# Altium schematic sheet Sheet0_Fontes_Chaveadas.SchDoc: Conversor Buck 24 V 100 W
size A4; Date: 15/11/2022; ApprovedBy: Prof. Me. Halisson Alves de Oliveira; CheckedBy: Manuel Batista Neto; Author: Artur Alves Torres de Araujo; DrawnBy: Artur Alves Torres de Araujo; Engineer: Artur Alves Torres de Araujo; Organization: UNIFOR - Universidade de Fortaleza; Address1: Av. Washington Soares, 1321; Address2: Edson Queiroz; Address3: CEP: 60811-905; Address4: Fortaleza - CE; DocumentNumber: 1; Revision: v1.0; SheetNumber: 1; SheetTotal: 4; Graduando: Artur Alves Torres de Araujo; matRevisor: 1710872; matAutor: 1610674; Time: 09:24:50
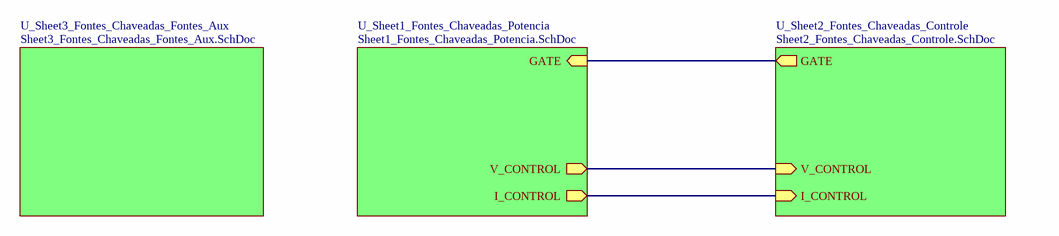
[diagram p0: Sheet0_Fontes_Chaveadas.SchDoc]

## Sub-sheets
U_Sheet1_Fontes_Chaveadas_Potencia = Sheet1_Fontes_Chaveadas_Potencia.SchDoc: I_CONTROL (out), GATE (in), V_CONTROL (out)
U_Sheet2_Fontes_Chaveadas_Controle = Sheet2_Fontes_Chaveadas_Controle.SchDoc: I_CONTROL (in), GATE (out), V_CONTROL (in)
U_Sheet3_Fontes_Chaveadas_Fontes_Aux = Sheet3_Fontes_Chaveadas_Fontes_Aux.SchDoc: no entries

## Nets
(unnamed): sheet U_Sheet1_Fontes_Chaveadas_Potencia/I_CONTROL, sheet U_Sheet2_Fontes_Chaveadas_Controle/I_CONTROL
(unnamed): sheet U_Sheet1_Fontes_Chaveadas_Potencia/GATE, sheet U_Sheet2_Fontes_Chaveadas_Controle/GATE
(unnamed): sheet U_Sheet1_Fontes_Chaveadas_Potencia/V_CONTROL, sheet U_Sheet2_Fontes_Chaveadas_Controle/V_CONTROL

## Notes on the sheet
- Título:
- Tamanho:
- Revisor:
- Autor:
- A4
- Data:
- Versão:
- Mat:
- Curso:
- Bacharelado em Engenharia Eletrônica
- Aprovado por:
- Disciplina:
- Projeto de Fontes Chaveadas
- Folha:
- de